# Altium schematic sheet Power_shifter.SchDoc
size A4; SheetNumber: 5; SheetTotal: 7; SPICEModelCacheWVRGNQJF: <root> / <DocumentId>WVRGNQJF</DocumentId> / <CacheFrame Number="0"> / <Model Name="res" Kind="MDL"> / <Text>*Default semiconductor resistor / .MODEL RES R()</Text> / </Model> / <Model Name="cap" Kind="MDL"> / <Text>*Default semiconductor capacitor / .MODEL CAP C()</Text> / </Model> / </CacheFrame> / </root>
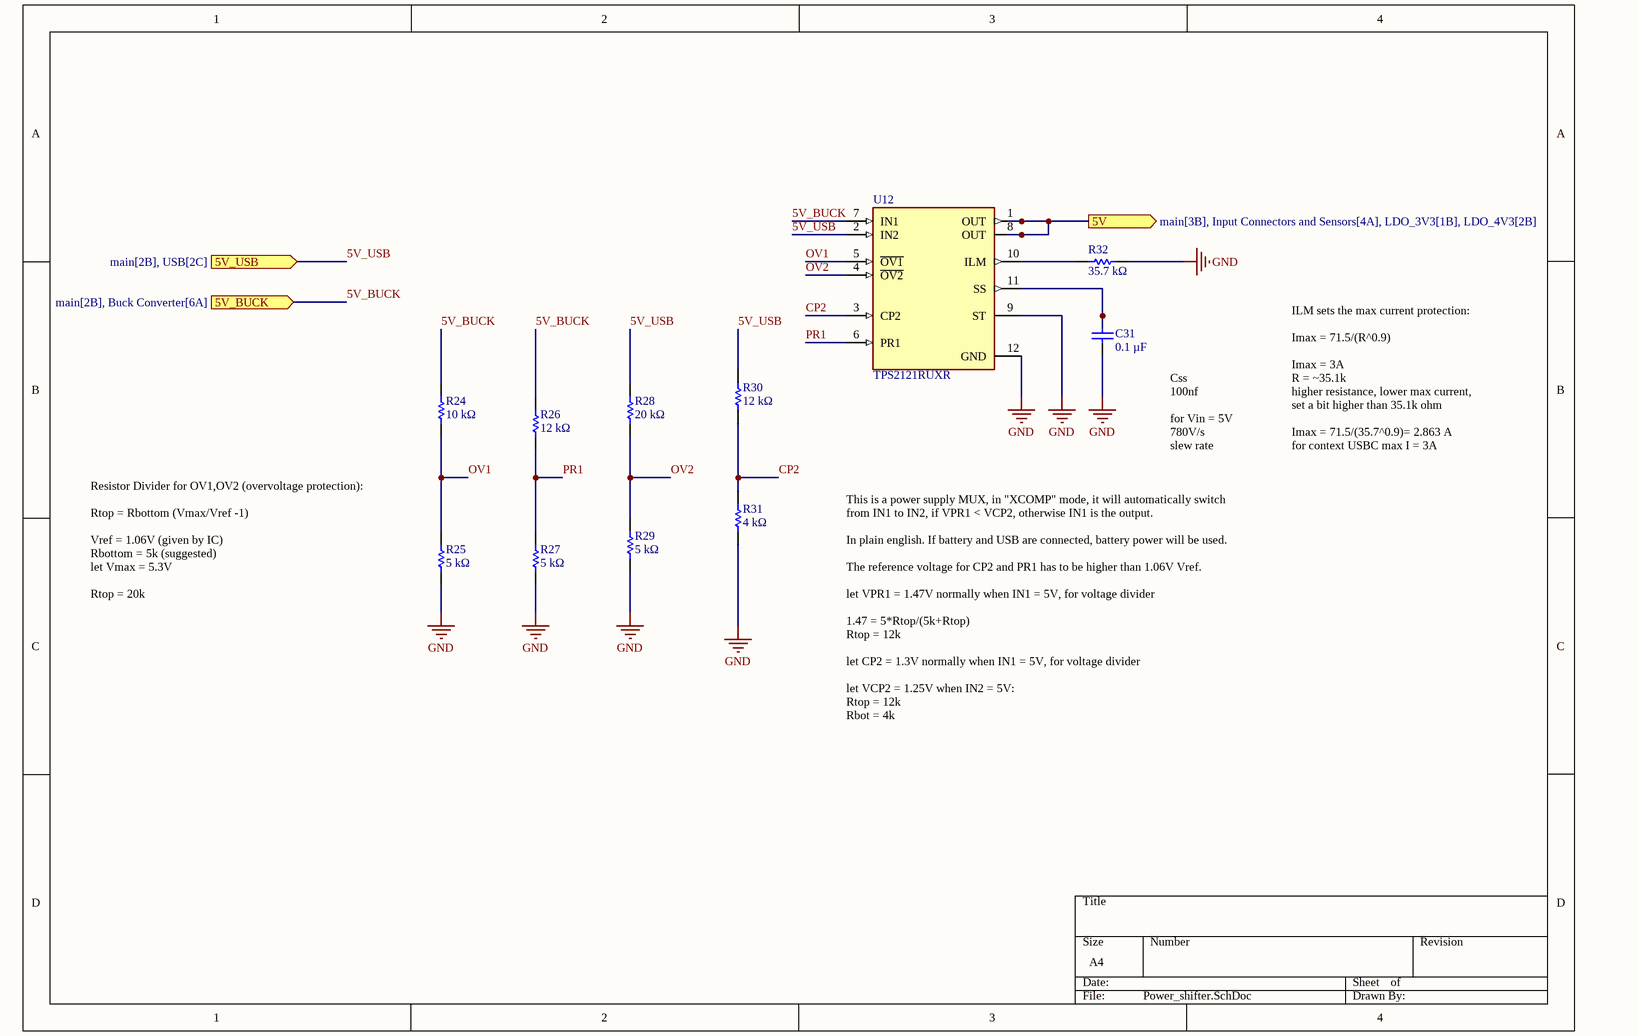
[diagram p0: Power_shifter.SchDoc]

## Parts
C31  0.1 µF  [0402_CAPC1005L]
R24  value 10 kΩ  [0402_RESC1005L]  (hidden comment: Res Semi)
R25  value 5 kΩ  [0402_RESC1005L]  (hidden comment: Res Semi)
R26  value 12 kΩ  [0402_RESC1005L]  (hidden comment: Res Semi)
R27  value 5 kΩ  [0402_RESC1005L]  (hidden comment: Res Semi)
R28  value 20 kΩ  [0402_RESC1005L]  (hidden comment: Res Semi)
R29  value 5 kΩ  [0402_RESC1005L]  (hidden comment: Res Semi)
R30  value 12 kΩ  [0402_RESC1005L]  (hidden comment: Res Semi)
R31  value 4 kΩ  [0402_RESC1005L]  (hidden comment: Res Semi)
R32  value 35.7 kΩ  [0402_RESC1005L]  (hidden comment: Res Semi)
U12  TPS2121RUXR  [FP-RUX0012A-MFG]

## Ports
5V (out, see main[3B], Input Connectors and Sensors[4A], LDO_3V3[1B], LDO_4V3[2B]), 5V_BUCK (in, see main[2B], Buck Converter[6A]), 5V_USB (in, see main[2B], USB[2C])

## Nets
GND: C31.2 R25.1 R27.1 R29.1 R31.1 R32.1 U12.9(ST) U12.12(GND)
5V: U12.1(OUT) U12.8(OUT) ; port 5V
5V_BUCK: R24.2 R26.2 U12.7(IN1) ; port 5V_BUCK
5V_USB: R28.2 R30.2 U12.2(IN2) ; port 5V_USB
CP2: R30.1 R31.2 U12.3(CP2)
OV1: R24.1 R25.2 U12.5(~{OV1})
OV2: R28.1 R29.2 U12.4(~{OV2})
PR1: R26.1 R27.2 U12.6(PR1)
NetC31_1: C31.1 U12.11(SS)
NetR32_2: R32.2 U12.10(ILM)

## Notes on the sheet
- ILM sets the max current protection:
  Imax = 71.5/(R^0.9)
  Imax = 3A
  R = ~35.1k
  higher resistance, lower max current,
  set a bit higher than 35.1k ohm
  Imax = 71.5/(35.7^0.9)= 2.863 A
  for context USBC max I = 3A
- Css
  100nf
  for Vin = 5V
  780V/s
  slew rate
- Resistor Divider for OV1,OV2 (overvoltage protection):
  Rtop = Rbottom (Vmax/Vref -1)
  Vref = 1.06V (given by IC)
  Rbottom = 5k (suggested)
  let Vmax = 5.3V
  Rtop = 20k
- This is a power supply MUX, in "XCOMP" mode, it will automatically switch from IN1 to IN2, if VPR1 < VCP2, otherwise IN1 is the output.
  In plain english. If battery and USB are connected, battery power will be used.
  The reference voltage for CP2 and PR1 has to be higher than 1.06V Vref.
  let VPR1 = 1.47V normally when IN1 = 5V, for voltage divider
  1.47 = 5*Rtop/(5k+Rtop)
  Rtop = 12k
  let CP2 = 1.3V normally when IN1 = 5V, for voltage divider
  let VCP2 = 1.25V when IN2 = 5V:
  Rtop = 12k
  Rbot = 4k
  therefore, when IN2 = 5V, it will switch to IN2 when IN1 = 4.25V

## Library data of the parts
C31 = Cap Semi: Capacitor (Semiconductor SIM Model); Published: 8-Jun-2000; LatestRevisionDate: 29-May-2009; LatestRevisionNote: IPC-7351 Footprint Added.; PackageReference: C1206; Publisher: Altium Limited; PackageDescription: Chip Capacitor; Digikey part#: *; Manufacturer: *; Manufacturer part#: *; Value: 0.1 µF
R24-R32 = Res Semi: Semiconductor Resistor; Published: 8-Jun-2000; LatestRevisionDate: 17-Jul-2002; LatestRevisionNote: Re-released for DXP Platform.; PackageReference: AXIAL-0.5; Publisher: Altium Limited; Digikey part#: *; Manufacturer: *; Manufacturer part#: *
U12 = CMP-04910-000009-1: PWR MGMT BATTERY MGMT; Manufacturer: Texas Instruments; Min Supply Voltage: 2.8V; Max Junction Temp: +125°C; Output Voltage: 22V; Output Current: 1.5-5.2A; Standoff Height: 0mm; Number Of Outputs: 1; Nominal Supply Current: 300uA; Device Class L2: Power Management ICs; Octopart: https://octopart.com/tps2121ruxr-texas+instruments-95511053; Mouser Description: 2.7-22V, 56m?, 4.5A, Priority Power MUX with Seamless Switchover 12-VQFN-HR -40 to 125; Lead Free: Yes; Digikey Description: PWR MGMT BATTERY MGMT; Manufacturer Part Number: TPS2121RUXR; Height: 1mm; Device Class L1: Integrated Circuits (ICs); Category: IC; Max Supply Voltage: 22V; ComponentLink2Description: Datasheet; Temperature: -40°C to +125°C; Temperature Range High: +125°C; ComponentLink2URL: https://www.ti.com/lit/ds/symlink/tps2121.pdf; Automotive: No; Package: RUX0012A; RoHS: TRUE; Device Class L3: unset; Temperature Range Low: -40°C